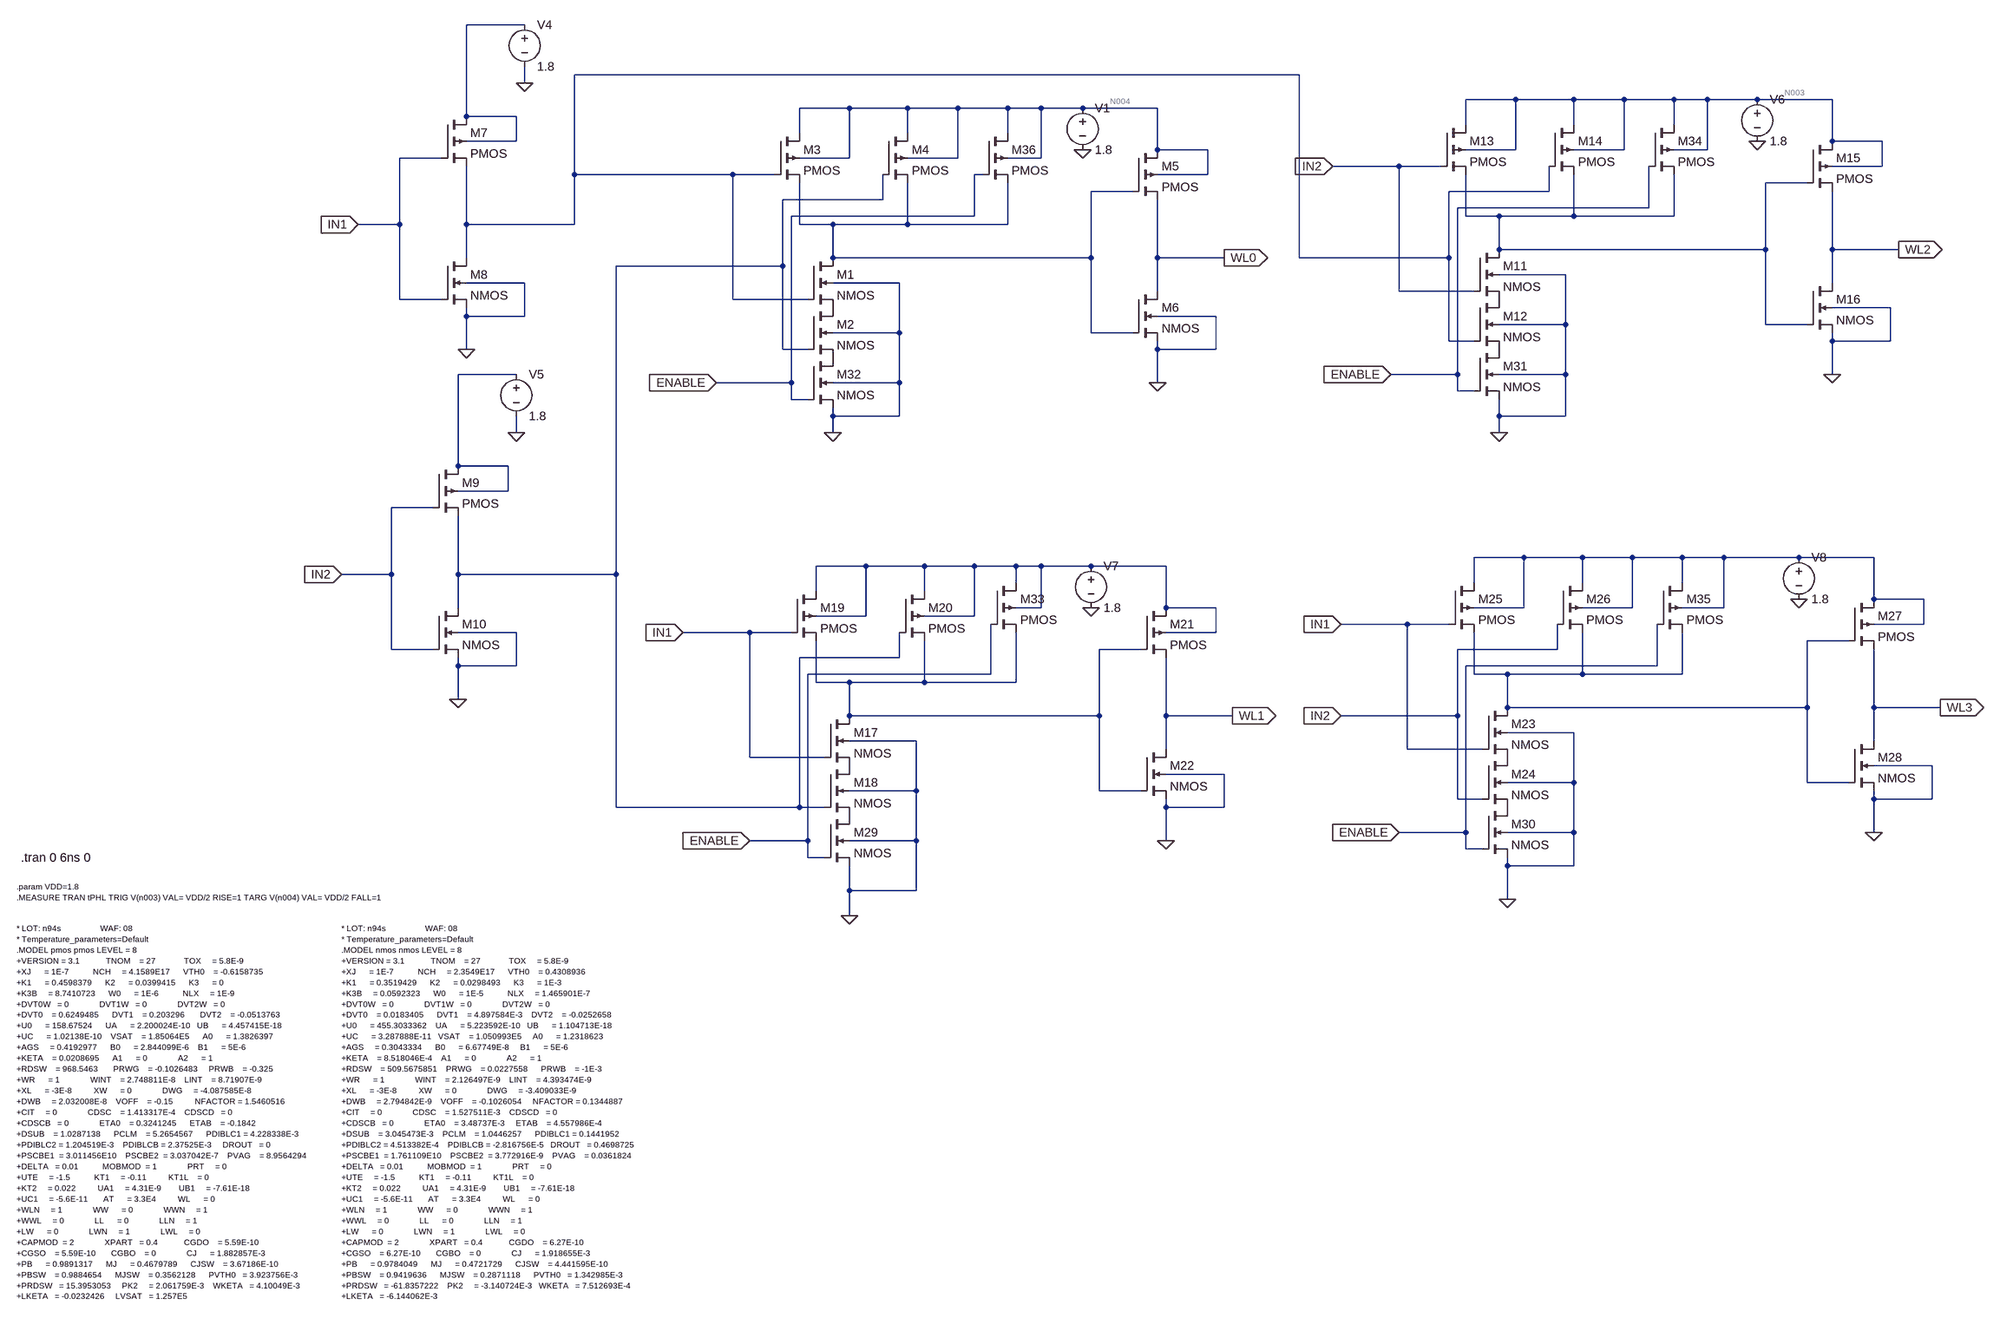
[diagram p0: schematic 2x4_DECODER_En.asc]
2x4_DECODER_En.asc, the LTspice schematic file:
Version 4
SHEET 1 2640 2144
WIRE -176 -112 -288 -112
WIRE 1312 -16 -80 -16
WIRE -176 0 -176 -32
WIRE 1728 32 1632 32
WIRE 1840 32 1728 32
WIRE 1936 32 1840 32
WIRE 2032 32 1936 32
WIRE 2096 32 2032 32
WIRE 2192 32 2096 32
WIRE 2336 32 2192 32
WIRE 448 48 352 48
WIRE 560 48 448 48
WIRE 656 48 560 48
WIRE 752 48 656 48
WIRE 816 48 752 48
WIRE 896 48 816 48
WIRE 1040 48 896 48
WIRE -288 64 -288 -112
WIRE -192 64 -288 64
WIRE 1632 80 1632 32
WIRE 1840 80 1840 32
WIRE 2032 80 2032 32
WIRE 352 96 352 48
WIRE 560 96 560 48
WIRE 752 96 752 48
WIRE -192 112 -192 64
WIRE -192 112 -288 112
WIRE 2336 112 2336 32
WIRE 2432 112 2336 112
WIRE 1040 128 1040 48
WIRE 1136 128 1040 128
WIRE 1728 128 1728 32
WIRE 1728 128 1632 128
WIRE 1936 128 1936 32
WIRE 1936 128 1840 128
WIRE 2096 128 2096 32
WIRE 2096 128 2032 128
WIRE -336 144 -416 144
WIRE 448 144 448 48
WIRE 448 144 352 144
WIRE 656 144 656 48
WIRE 656 144 560 144
WIRE 816 144 816 48
WIRE 816 144 752 144
WIRE 1504 160 1376 160
WIRE 1584 160 1504 160
WIRE 2432 160 2432 112
WIRE 2432 160 2336 160
WIRE -80 176 -80 -16
WIRE 224 176 -80 176
WIRE 304 176 224 176
WIRE 704 176 688 176
WIRE 1136 176 1136 128
WIRE 1136 176 1040 176
WIRE 2288 192 2208 192
WIRE 992 208 912 208
WIRE 1792 208 1792 160
WIRE 1792 208 1600 208
WIRE 512 224 512 176
WIRE 512 224 320 224
WIRE 1984 240 1984 160
WIRE 1984 240 1616 240
WIRE 688 256 688 176
WIRE 688 256 336 256
WIRE 1632 256 1632 176
WIRE 1696 256 1632 256
WIRE 1840 256 1840 176
WIRE 1840 256 1696 256
WIRE 2032 256 2032 176
WIRE 2032 256 1840 256
WIRE -416 272 -416 144
WIRE -416 272 -496 272
WIRE -288 272 -288 160
WIRE -80 272 -80 176
WIRE -80 272 -288 272
WIRE 352 272 352 192
WIRE 416 272 352 272
WIRE 560 272 560 192
WIRE 560 272 416 272
WIRE 752 272 752 192
WIRE 752 272 560 272
WIRE 1696 320 1696 256
WIRE 2208 320 2208 192
WIRE 2208 320 1696 320
WIRE 2336 320 2336 208
WIRE 2464 320 2336 320
WIRE -288 336 -288 272
WIRE 416 336 416 272
WIRE 912 336 912 208
WIRE 912 336 416 336
WIRE 1040 336 1040 224
WIRE 1168 336 1040 336
WIRE 1312 336 1312 -16
WIRE 1600 336 1600 208
WIRE 1600 336 1312 336
WIRE 320 352 320 224
WIRE 320 352 0 352
WIRE 1824 368 1696 368
WIRE -176 384 -288 384
WIRE 544 384 416 384
WIRE 2336 384 2336 320
WIRE 1040 400 1040 336
WIRE 1504 400 1504 160
WIRE 1648 400 1504 400
WIRE -416 416 -416 272
WIRE -336 416 -416 416
WIRE 224 416 224 176
WIRE 368 416 224 416
WIRE 2448 432 2336 432
WIRE -288 448 -288 432
WIRE -176 448 -176 384
WIRE -176 448 -288 448
WIRE 1152 448 1040 448
WIRE 1824 464 1824 368
WIRE 1824 464 1696 464
WIRE 2208 464 2208 320
WIRE 2288 464 2208 464
WIRE 544 480 544 384
WIRE 544 480 416 480
WIRE 912 480 912 336
WIRE 992 480 912 480
WIRE 1600 496 1600 336
WIRE 1648 496 1600 496
WIRE 2336 496 2336 480
WIRE 2448 496 2448 432
WIRE 2448 496 2336 496
WIRE -288 512 -288 448
WIRE 320 512 320 352
WIRE 368 512 320 512
WIRE 1040 512 1040 496
WIRE 1152 512 1152 448
WIRE 1152 512 1040 512
WIRE -192 560 -304 560
WIRE 1616 560 1616 240
WIRE 1616 560 1488 560
WIRE 1824 560 1824 464
WIRE 1824 560 1696 560
WIRE 2336 560 2336 496
WIRE 336 576 336 256
WIRE 336 576 192 576
WIRE 544 576 544 480
WIRE 544 576 416 576
WIRE 1040 576 1040 512
WIRE 1616 592 1616 560
WIRE 1648 592 1616 592
WIRE 336 608 336 576
WIRE 368 608 336 608
WIRE 416 640 416 624
WIRE 544 640 544 576
WIRE 544 640 416 640
WIRE 1696 640 1696 608
WIRE 1824 640 1824 560
WIRE 1824 640 1696 640
WIRE -192 672 -192 640
WIRE 416 672 416 640
WIRE 1696 672 1696 640
WIRE -304 736 -304 560
WIRE -208 736 -304 736
WIRE -208 784 -208 736
WIRE -208 784 -304 784
WIRE -352 816 -432 816
WIRE 1744 912 1648 912
WIRE 1856 912 1744 912
WIRE 1952 912 1856 912
WIRE 2048 912 1952 912
WIRE 2128 912 2048 912
WIRE 2272 912 2128 912
WIRE 2416 912 2272 912
WIRE 480 928 384 928
WIRE 592 928 480 928
WIRE 688 928 592 928
WIRE 768 928 688 928
WIRE 816 928 768 928
WIRE 912 928 816 928
WIRE 1056 928 912 928
WIRE -432 944 -432 816
WIRE -432 944 -528 944
WIRE -304 944 -304 832
WIRE 0 944 0 352
WIRE 0 944 -304 944
WIRE 768 960 768 928
WIRE 1648 960 1648 912
WIRE 1856 960 1856 912
WIRE 2048 960 2048 912
WIRE 384 976 384 928
WIRE 592 976 592 928
WIRE 2416 992 2416 912
WIRE 2512 992 2416 992
WIRE -304 1008 -304 944
WIRE 816 1008 816 928
WIRE 816 1008 768 1008
WIRE 1056 1008 1056 928
WIRE 1152 1008 1056 1008
WIRE 1744 1008 1744 912
WIRE 1744 1008 1648 1008
WIRE 1952 1008 1952 912
WIRE 1952 1008 1856 1008
WIRE 2128 1008 2128 912
WIRE 2128 1008 2048 1008
WIRE 480 1024 480 928
WIRE 480 1024 384 1024
WIRE 688 1024 688 928
WIRE 688 1024 592 1024
WIRE 1520 1040 1392 1040
WIRE 1600 1040 1520 1040
WIRE 2512 1040 2512 992
WIRE 2512 1040 2416 1040
WIRE -192 1056 -304 1056
WIRE 256 1056 128 1056
WIRE 336 1056 256 1056
WIRE 1152 1056 1152 1008
WIRE 1152 1056 1056 1056
WIRE 2368 1072 2288 1072
WIRE -432 1088 -432 944
WIRE -352 1088 -432 1088
WIRE 1008 1088 928 1088
WIRE 1808 1088 1808 1040
WIRE 1808 1088 1616 1088
WIRE 544 1104 544 1056
WIRE 544 1104 352 1104
WIRE -304 1120 -304 1104
WIRE -192 1120 -192 1056
WIRE -192 1120 -304 1120
WIRE 2000 1120 2000 1040
WIRE 2000 1120 1632 1120
WIRE 720 1136 720 1040
WIRE 720 1136 368 1136
WIRE 1648 1136 1648 1056
WIRE 1712 1136 1648 1136
WIRE 1856 1136 1856 1056
WIRE 1856 1136 1712 1136
WIRE 2048 1136 2048 1056
WIRE 2048 1136 1856 1136
WIRE 384 1152 384 1072
WIRE 448 1152 384 1152
WIRE 592 1152 592 1072
WIRE 592 1152 448 1152
WIRE 768 1152 768 1056
WIRE 768 1152 592 1152
WIRE -304 1184 -304 1120
WIRE 1712 1200 1712 1136
WIRE 2288 1200 2288 1072
WIRE 2288 1200 1712 1200
WIRE 2416 1200 2416 1088
WIRE 2544 1200 2416 1200
WIRE 448 1216 448 1152
WIRE 928 1216 928 1088
WIRE 928 1216 448 1216
WIRE 1056 1216 1056 1104
WIRE 1184 1216 1056 1216
WIRE 1616 1216 1616 1088
WIRE 1616 1216 1392 1216
WIRE 1840 1248 1712 1248
WIRE 576 1264 448 1264
WIRE 2416 1264 2416 1200
WIRE 1056 1280 1056 1216
WIRE 1520 1280 1520 1040
WIRE 1664 1280 1520 1280
WIRE 256 1296 256 1056
WIRE 400 1296 256 1296
WIRE 2528 1312 2416 1312
WIRE 1168 1328 1056 1328
WIRE 1840 1344 1840 1248
WIRE 1840 1344 1712 1344
WIRE 2288 1344 2288 1200
WIRE 2368 1344 2288 1344
WIRE 576 1360 576 1264
WIRE 576 1360 448 1360
WIRE 928 1360 928 1216
WIRE 1008 1360 928 1360
WIRE 1616 1376 1616 1216
WIRE 1664 1376 1616 1376
WIRE 2416 1376 2416 1360
WIRE 2528 1376 2528 1312
WIRE 2528 1376 2416 1376
WIRE 0 1392 0 944
WIRE 352 1392 352 1104
WIRE 352 1392 0 1392
WIRE 400 1392 352 1392
WIRE 1056 1392 1056 1376
WIRE 1168 1392 1168 1328
WIRE 1168 1392 1056 1392
WIRE 1632 1440 1632 1120
WIRE 1632 1440 1504 1440
WIRE 1840 1440 1840 1344
WIRE 1840 1440 1712 1440
WIRE 2416 1440 2416 1376
WIRE 368 1456 368 1136
WIRE 368 1456 256 1456
WIRE 576 1456 576 1360
WIRE 576 1456 448 1456
WIRE 1056 1456 1056 1392
WIRE 1632 1472 1632 1440
WIRE 1664 1472 1632 1472
WIRE 368 1488 368 1456
WIRE 400 1488 368 1488
WIRE 1712 1504 1712 1488
WIRE 1840 1504 1840 1440
WIRE 1840 1504 1712 1504
WIRE 448 1552 448 1504
WIRE 576 1552 576 1456
WIRE 576 1552 448 1552
WIRE 1712 1568 1712 1504
WIRE 448 1600 448 1552
FLAG 896 128 0
FLAG 1040 576 0
FLAG -288 512 0
FLAG -176 0 0
FLAG -304 1184 0
FLAG -192 672 0
FLAG -496 272 IN1
IOPIN -496 272 In
FLAG -528 944 IN2
IOPIN -528 944 In
FLAG 2192 112 0
FLAG 2336 560 0
FLAG 912 1008 0
FLAG 1056 1456 0
FLAG 2272 992 0
FLAG 2416 1440 0
FLAG 128 1056 IN1
IOPIN 128 1056 In
FLAG 1376 160 IN2
IOPIN 1376 160 In
FLAG 1392 1040 IN1
IOPIN 1392 1040 In
FLAG 1392 1216 IN2
IOPIN 1392 1216 In
FLAG 1168 336 WL0
IOPIN 1168 336 Out
FLAG 1184 1216 WL1
IOPIN 1184 1216 Out
FLAG 2464 320 WL2
IOPIN 2464 320 Out
FLAG 2544 1200 WL3
IOPIN 2544 1200 Out
FLAG 416 672 0
FLAG 1696 672 0
FLAG 1712 1568 0
FLAG 448 1600 0
FLAG 192 576 ENABLE
IOPIN 192 576 In
FLAG 256 1456 ENABLE
IOPIN 256 1456 In
FLAG 1488 560 ENABLE
IOPIN 1488 560 In
FLAG 1504 1440 ENABLE
IOPIN 1504 1440 In
SYMBOL nmos4 368 336 R0
SYMATTR InstName M1
SYMATTR Value2 l=180n w=1320n
SYMBOL nmos4 368 432 R0
SYMATTR InstName M2
SYMATTR Value2 l=180n w=1320n
SYMBOL pmos4 304 96 R0
SYMATTR InstName M3
SYMATTR Value2 l=180n w=880n
SYMBOL pmos4 512 96 R0
SYMATTR InstName M4
SYMATTR Value2 l=180n w=880n
SYMBOL Voltage 896 32 R0
SYMATTR InstName V1
SYMATTR Value 1.8
SYMBOL pmos4 992 128 R0
SYMATTR InstName M5
SYMATTR Value2 l=180n w=880n
SYMBOL nmos4 992 400 R0
SYMATTR InstName M6
SYMATTR Value2 l=180n w=440n
SYMBOL pmos4 -336 64 R0
SYMATTR InstName M7
SYMATTR Value2 l=180n w=880n
SYMBOL nmos4 -336 336 R0
SYMATTR InstName M8
SYMATTR Value2 l=180n w=440n
SYMBOL voltage -176 -128 R0
SYMATTR InstName V4
SYMATTR Value 1.8
SYMBOL pmos4 -352 736 R0
SYMATTR InstName M9
SYMATTR Value2 l=180n w=880n
SYMBOL nmos4 -352 1008 R0
SYMATTR InstName M10
SYMATTR Value2 l=180n w=440n
SYMBOL voltage -192 544 R0
SYMATTR InstName V5
SYMATTR Value 1.8
SYMBOL nmos4 1648 320 R0
SYMATTR InstName M11
SYMATTR Value2 l=180n w=1320n
SYMBOL nmos4 1648 416 R0
SYMATTR InstName M12
SYMATTR Value2 l=180n w=1320n
SYMBOL pmos4 1584 80 R0
SYMATTR InstName M13
SYMATTR Value2 l=180n w=880n
SYMBOL pmos4 1792 80 R0
SYMATTR InstName M14
SYMATTR Value2 l=180n w=880n
SYMBOL Voltage 2192 16 R0
SYMATTR InstName V6
SYMATTR Value 1.8
SYMBOL pmos4 2288 112 R0
SYMATTR InstName M15
SYMATTR Value2 l=180n w=880n
SYMBOL nmos4 2288 384 R0
SYMATTR InstName M16
SYMATTR Value2 l=180n w=440n
SYMBOL nmos4 400 1216 R0
SYMATTR InstName M17
SYMATTR Value2 l=180n w=1320n
SYMBOL nmos4 400 1312 R0
SYMATTR InstName M18
SYMATTR Value2 l=180n w=1320n
SYMBOL pmos4 336 976 R0
SYMATTR InstName M19
SYMATTR Value2 l=180n w=880n
SYMBOL pmos4 544 976 R0
SYMATTR InstName M20
SYMATTR Value2 l=180n w=880n
SYMBOL Voltage 912 912 R0
SYMATTR InstName V7
SYMATTR Value 1.8
SYMBOL pmos4 1008 1008 R0
SYMATTR InstName M21
SYMATTR Value2 l=180n w=880n
SYMBOL nmos4 1008 1280 R0
SYMATTR InstName M22
SYMATTR Value2 l=180n w=440n
SYMBOL nmos4 1664 1200 R0
SYMATTR InstName M23
SYMATTR Value2 l=180n w=1320n
SYMBOL nmos4 1664 1296 R0
SYMATTR InstName M24
SYMATTR Value2 l=180n w=1320n
SYMBOL pmos4 1600 960 R0
SYMATTR InstName M25
SYMATTR Value2 l=180n w=880n
SYMBOL pmos4 1808 960 R0
SYMATTR InstName M26
SYMATTR Value2 l=180n w=880n
SYMBOL Voltage 2272 896 R0
SYMATTR InstName V8
SYMATTR Value 1.8
SYMBOL pmos4 2368 992 R0
SYMATTR InstName M27
SYMATTR Value2 l=180n w=880n
SYMBOL nmos4 2368 1264 R0
SYMATTR InstName M28
SYMATTR Value2 l=180n w=440n
SYMBOL nmos4 400 1408 R0
SYMATTR InstName M29
SYMATTR Value2 l=180n w=1320n
SYMBOL nmos4 1664 1392 R0
SYMATTR InstName M30
SYMATTR Value2 l=180n w=1320n
SYMBOL nmos4 1648 512 R0
SYMATTR InstName M31
SYMATTR Value2 l=180n w=1320n
SYMBOL nmos4 368 528 R0
SYMATTR InstName M32
SYMATTR Value2 l=180n w=1320n
SYMBOL pmos4 720 960 R0
SYMATTR InstName M33
SYMATTR Value2 l=180n w=880n
SYMBOL pmos4 1984 80 R0
SYMATTR InstName M34
SYMATTR Value2 l=180n w=880n
SYMBOL pmos4 2000 960 R0
SYMATTR InstName M35
SYMATTR Value2 l=180n w=880n
SYMBOL pmos4 704 96 R0
SYMATTR InstName M36
SYMATTR Value2 l=180n w=880n
TEXT -1152 1624 Left 1 !* LOT: n94s                  WAF: 08\n* Temperature_parameters=Default\n.MODEL pmos pmos LEVEL = 8\n+VERSION = 3.1            TNOM    = 27             TOX     = 5.8E-9\n+XJ      = 1E-7           NCH     = 4.1589E17      VTH0    = -0.6158735\n+K1      = 0.4598379      K2      = 0.0399415      K3      = 0\n+K3B     = 8.7410723      W0      = 1E-6           NLX     = 1E-9\n+DVT0W   = 0              DVT1W   = 0              DVT2W   = 0\n+DVT0    = 0.6249485      DVT1    = 0.203296       DVT2    = -0.0513763\n+U0      = 158.67524      UA      = 2.200024E-10   UB      = 4.457415E-18\n+UC      = 1.02138E-10    VSAT    = 1.85064E5      A0      = 1.3826397\n+AGS     = 0.4192977      B0      = 2.844099E-6    B1      = 5E-6\n+KETA    = 0.0208695      A1      = 0              A2      = 1\n+RDSW    = 968.5463       PRWG    = -0.1026483     PRWB    = -0.325\n+WR      = 1              WINT    = 2.748811E-8    LINT    = 8.71907E-9\n+XL      = -3E-8          XW      = 0              DWG     = -4.087585E-8\n+DWB     = 2.032008E-8    VOFF    = -0.15          NFACTOR = 1.5460516\n+CIT     = 0              CDSC    = 1.413317E-4    CDSCD   = 0\n+CDSCB   = 0              ETA0    = 0.3241245      ETAB    = -0.1842\n+DSUB    = 1.0287138      PCLM    = 5.2654567      PDIBLC1 = 4.228338E-3\n+PDIBLC2 = 1.204519E-3    PDIBLCB = 2.37525E-3     DROUT   = 0\n+PSCBE1  = 3.011456E10    PSCBE2  = 3.037042E-7    PVAG    = 8.9564294\n+DELTA   = 0.01           MOBMOD  = 1              PRT     = 0\n+UTE     = -1.5           KT1     = -0.11          KT1L    = 0\n+KT2     = 0.022          UA1     = 4.31E-9        UB1     = -7.61E-18\n+UC1     = -5.6E-11       AT      = 3.3E4          WL      = 0\n+WLN     = 1              WW      = 0              WWN     = 1\n+WWL     = 0              LL      = 0              LLN     = 1\n+LW      = 0              LWN     = 1              LWL     = 0\n+CAPMOD  = 2              XPART   = 0.4            CGDO    = 5.59E-10\n+CGSO    = 5.59E-10       CGBO    = 0              CJ      = 1.882857E-3\n+PB      = 0.9891317      MJ      = 0.4679789      CJSW    = 3.67186E-10\n+PBSW    = 0.9884654      MJSW    = 0.3562128      PVTH0   = 3.923756E-3\n+PRDSW   = 15.3953053     PK2     = 2.061759E-3    WKETA   = 4.10049E-3\n+LKETA   = -0.0232426     LVSAT   = 1.257E5
TEXT -528 1624 Left 1 !* LOT: n94s                  WAF: 08\n* Temperature_parameters=Default\n.MODEL nmos nmos LEVEL = 8\n+VERSION = 3.1            TNOM    = 27             TOX     = 5.8E-9\n+XJ      = 1E-7           NCH     = 2.3549E17      VTH0    = 0.4308936\n+K1      = 0.3519429      K2      = 0.0298493      K3      = 1E-3\n+K3B     = 0.0592323      W0      = 1E-5           NLX     = 1.465901E-7\n+DVT0W   = 0              DVT1W   = 0              DVT2W   = 0\n+DVT0    = 0.0183405      DVT1    = 4.897584E-3    DVT2    = -0.0252658\n+U0      = 455.3033362    UA      = 5.223592E-10   UB      = 1.104713E-18\n+UC      = 3.287888E-11   VSAT    = 1.050993E5     A0      = 1.2318623\n+AGS     = 0.3043334      B0      = 6.67749E-8     B1      = 5E-6\n+KETA    = 8.518046E-4    A1      = 0              A2      = 1\n+RDSW    = 509.5675851    PRWG    = 0.0227558      PRWB    = -1E-3\n+WR      = 1              WINT    = 2.126497E-9    LINT    = 4.393474E-9\n+XL      = -3E-8          XW      = 0              DWG     = -3.409033E-9\n+DWB     = 2.794842E-9    VOFF    = -0.1026054     NFACTOR = 0.1344887\n+CIT     = 0              CDSC    = 1.527511E-3    CDSCD   = 0\n+CDSCB   = 0              ETA0    = 3.48737E-3     ETAB    = 4.557986E-4\n+DSUB    = 3.045473E-3    PCLM    = 1.0446257      PDIBLC1 = 0.1441952\n+PDIBLC2 = 4.513382E-4    PDIBLCB = -2.816756E-5   DROUT   = 0.4698725\n+PSCBE1  = 1.761109E10    PSCBE2  = 3.772916E-9    PVAG    = 0.0361824\n+DELTA   = 0.01           MOBMOD  = 1              PRT     = 0\n+UTE     = -1.5           KT1     = -0.11          KT1L    = 0\n+KT2     = 0.022          UA1     = 4.31E-9        UB1     = -7.61E-18\n+UC1     = -5.6E-11       AT      = 3.3E4          WL      = 0\n+WLN     = 1              WW      = 0              WWN     = 1\n+WWL     = 0              LL      = 0              LLN     = 1\n+LW      = 0              LWN     = 1              LWL     = 0\n+CAPMOD  = 2              XPART   = 0.4            CGDO    = 6.27E-10\n+CGSO    = 6.27E-10       CGBO    = 0              CJ      = 1.918655E-3\n+PB      = 0.9784049      MJ      = 0.4721729      CJSW    = 4.441595E-10\n+PBSW    = 0.9419636      MJSW    = 0.2871118      PVTH0   = 1.342985E-3\n+PRDSW   = -61.8357222    PK2     = -3.140724E-3   WKETA   = 7.512693E-4\n+LKETA   = -6.144062E-3
TEXT -1144 1488 Left 2 !.tran 0 6ns 0
TEXT -1152 1544 Left 1 !.param VDD=1.8\n.MEASURE TRAN tPHL TRIG V(n003) VAL= VDD/2 RISE=1 TARG V(n004) VAL= VDD/2 FALL=1

The netlist it stands for:
* 2x4_DECODER_En.asc
M1 N006 N002 P001 0 NMOS l=180n w=1320n
M2 P001 N007 P002 0 NMOS l=180n w=1320n
M3 N004 N002 N006 N004 PMOS l=180n w=880n
M4 N004 N007 N006 N004 PMOS l=180n w=880n
V1 N004 0 1.8
M5 N004 N006 WL0 N004 PMOS l=180n w=880n
M6 WL0 N006 0 0 NMOS l=180n w=440n
M7 N001 IN1 N002 N001 PMOS l=180n w=880n
M8 N002 IN1 0 0 NMOS l=180n w=440n
V4 N001 0 1.8
M9 N008 IN2 N007 N008 PMOS l=180n w=880n
M10 N007 IN2 0 0 NMOS l=180n w=440n
V5 N008 0 1.8
M11 N005 IN2 P003 0 NMOS l=180n w=1320n
M12 P003 N002 P004 0 NMOS l=180n w=1320n
M13 N003 IN2 N005 N003 PMOS l=180n w=880n
M14 N003 N002 N005 N003 PMOS l=180n w=880n
V6 N003 0 1.8
M15 N003 N005 WL2 N003 PMOS l=180n w=880n
M16 WL2 N005 0 0 NMOS l=180n w=440n
M17 N012 IN1 P005 0 NMOS l=180n w=1320n
M18 P005 N007 P006 0 NMOS l=180n w=1320n
M19 N010 IN1 N012 N010 PMOS l=180n w=880n
M20 N010 N007 N012 N010 PMOS l=180n w=880n
V7 N010 0 1.8
M21 N010 N012 WL1 N010 PMOS l=180n w=880n
M22 WL1 N012 0 0 NMOS l=180n w=440n
M23 N011 IN1 P007 0 NMOS l=180n w=1320n
M24 P007 IN2 P008 0 NMOS l=180n w=1320n
M25 N009 IN1 N011 N009 PMOS l=180n w=880n
M26 N009 IN2 N011 N009 PMOS l=180n w=880n
V8 N009 0 1.8
M27 N009 N011 WL3 N009 PMOS l=180n w=880n
M28 WL3 N011 0 0 NMOS l=180n w=440n
M29 P006 ENABLE 0 0 NMOS l=180n w=1320n
M30 P008 ENABLE 0 0 NMOS l=180n w=1320n
M31 P004 ENABLE 0 0 NMOS l=180n w=1320n
M32 P002 ENABLE 0 0 NMOS l=180n w=1320n
M33 N010 ENABLE N012 N010 PMOS l=180n w=880n
M34 N003 ENABLE N005 N003 PMOS l=180n w=880n
M35 N009 ENABLE N011 N009 PMOS l=180n w=880n
M36 N004 ENABLE N006 N004 PMOS l=180n w=880n
.model NMOS NMOS
.model PMOS PMOS
.lib standard.mos
* LOT: n94s                  WAF: 08
* Temperature_parameters=Default
.MODEL pmos pmos LEVEL = 8
+VERSION = 3.1            TNOM    = 27             TOX     = 5.8E-9
+XJ      = 1E-7           NCH     = 4.1589E17      VTH0    = -0.6158735
+K1      = 0.4598379      K2      = 0.0399415      K3      = 0
+K3B     = 8.7410723      W0      = 1E-6           NLX     = 1E-9
+DVT0W   = 0              DVT1W   = 0              DVT2W   = 0
+DVT0    = 0.6249485      DVT1    = 0.203296       DVT2    = -0.0513763
+U0      = 158.67524      UA      = 2.200024E-10   UB      = 4.457415E-18
+UC      = 1.02138E-10    VSAT    = 1.85064E5      A0      = 1.3826397
+AGS     = 0.4192977      B0      = 2.844099E-6    B1      = 5E-6
+KETA    = 0.0208695      A1      = 0              A2      = 1
+RDSW    = 968.5463       PRWG    = -0.1026483     PRWB    = -0.325
+WR      = 1              WINT    = 2.748811E-8    LINT    = 8.71907E-9
+XL      = -3E-8          XW      = 0              DWG     = -4.087585E-8
+DWB     = 2.032008E-8    VOFF    = -0.15          NFACTOR = 1.5460516
+CIT     = 0              CDSC    = 1.413317E-4    CDSCD   = 0
+CDSCB   = 0              ETA0    = 0.3241245      ETAB    = -0.1842
+DSUB    = 1.0287138      PCLM    = 5.2654567      PDIBLC1 = 4.228338E-3
+PDIBLC2 = 1.204519E-3    PDIBLCB = 2.37525E-3     DROUT   = 0
+PSCBE1  = 3.011456E10    PSCBE2  = 3.037042E-7    PVAG    = 8.9564294
+DELTA   = 0.01           MOBMOD  = 1              PRT     = 0
+UTE     = -1.5           KT1     = -0.11          KT1L    = 0
+KT2     = 0.022          UA1     = 4.31E-9        UB1     = -7.61E-18
+UC1     = -5.6E-11       AT      = 3.3E4          WL      = 0
+WLN     = 1              WW      = 0              WWN     = 1
+WWL     = 0              LL      = 0              LLN     = 1
+LW      = 0              LWN     = 1              LWL     = 0
+CAPMOD  = 2              XPART   = 0.4            CGDO    = 5.59E-10
+CGSO    = 5.59E-10       CGBO    = 0              CJ      = 1.882857E-3
+PB      = 0.9891317      MJ      = 0.4679789      CJSW    = 3.67186E-10
+PBSW    = 0.9884654      MJSW    = 0.3562128      PVTH0   = 3.923756E-3
+PRDSW   = 15.3953053     PK2     = 2.061759E-3    WKETA   = 4.10049E-3
+LKETA   = -0.0232426     LVSAT   = 1.257E5
* LOT: n94s                  WAF: 08
* Temperature_parameters=Default
.MODEL nmos nmos LEVEL = 8
+VERSION = 3.1            TNOM    = 27             TOX     = 5.8E-9
+XJ      = 1E-7           NCH     = 2.3549E17      VTH0    = 0.4308936
+K1      = 0.3519429      K2      = 0.0298493      K3      = 1E-3
+K3B     = 0.0592323      W0      = 1E-5           NLX     = 1.465901E-7
+DVT0W   = 0              DVT1W   = 0              DVT2W   = 0
+DVT0    = 0.0183405      DVT1    = 4.897584E-3    DVT2    = -0.0252658
+U0      = 455.3033362    UA      = 5.223592E-10   UB      = 1.104713E-18
+UC      = 3.287888E-11   VSAT    = 1.050993E5     A0      = 1.2318623
+AGS     = 0.3043334      B0      = 6.67749E-8     B1      = 5E-6
+KETA    = 8.518046E-4    A1      = 0              A2      = 1
+RDSW    = 509.5675851    PRWG    = 0.0227558      PRWB    = -1E-3
+WR      = 1              WINT    = 2.126497E-9    LINT    = 4.393474E-9
+XL      = -3E-8          XW      = 0              DWG     = -3.409033E-9
+DWB     = 2.794842E-9    VOFF    = -0.1026054     NFACTOR = 0.1344887
+CIT     = 0              CDSC    = 1.527511E-3    CDSCD   = 0
+CDSCB   = 0              ETA0    = 3.48737E-3     ETAB    = 4.557986E-4
+DSUB    = 3.045473E-3    PCLM    = 1.0446257      PDIBLC1 = 0.1441952
+PDIBLC2 = 4.513382E-4    PDIBLCB = -2.816756E-5   DROUT   = 0.4698725
+PSCBE1  = 1.761109E10    PSCBE2  = 3.772916E-9    PVAG    = 0.0361824
+DELTA   = 0.01           MOBMOD  = 1              PRT     = 0
+UTE     = -1.5           KT1     = -0.11          KT1L    = 0
+KT2     = 0.022          UA1     = 4.31E-9        UB1     = -7.61E-18
+UC1     = -5.6E-11       AT      = 3.3E4          WL      = 0
+WLN     = 1              WW      = 0              WWN     = 1
+WWL     = 0              LL      = 0              LLN     = 1
+LW      = 0              LWN     = 1              LWL     = 0
+CAPMOD  = 2              XPART   = 0.4            CGDO    = 6.27E-10
+CGSO    = 6.27E-10       CGBO    = 0              CJ      = 1.918655E-3
+PB      = 0.9784049      MJ      = 0.4721729      CJSW    = 4.441595E-10
+PBSW    = 0.9419636      MJSW    = 0.2871118      PVTH0   = 1.342985E-3
+PRDSW   = -61.8357222    PK2     = -3.140724E-3   WKETA   = 7.512693E-4
+LKETA   = -6.144062E-3
.tran 0 6ns 0
.param VDD=1.8
.MEASURE TRAN tPHL TRIG V(n003) VAL= VDD/2 RISE=1 TARG V(n004) VAL= VDD/2 FALL=1
.backanno
.end